# Altium schematic sheet Analogs.SchDoc
size A4
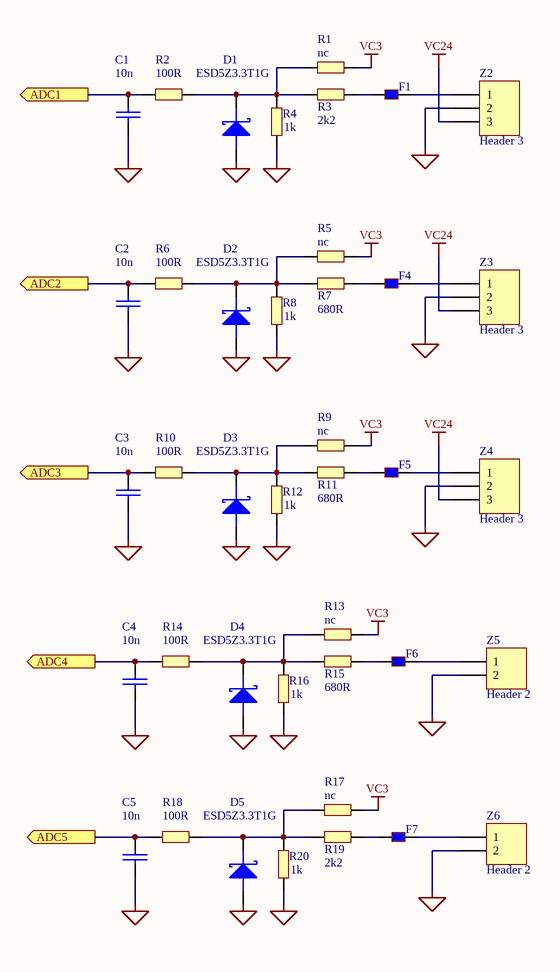
[diagram p0: Analogs.SchDoc]

## Parts
C1  10n  [0805C]
C2  10n  [0805C]
C3  10n  [0805C]
C4  10n  [0805C]
C5  10n  [0805C]
D1  ESD5Z3.3T1G  [SOD_523]
D2  ESD5Z3.3T1G  [SOD_523]
D3  ESD5Z3.3T1G  [SOD_523]
D4  ESD5Z3.3T1G  [SOD_523]
D5  ESD5Z3.3T1G  [SOD_523]
F1  BLM18BB141SN1D  [0805L]  (value not drawn)
F4  BLM18BB141SN1D  [0805L]  (value not drawn)
F5  BLM18BB141SN1D  [0805L]  (value not drawn)
F6  BLM18BB141SN1D  [0805L]  (value not drawn)
F7  BLM18BB141SN1D  [0805L]  (value not drawn)
R1  nc  [0805R]
R2  100R  [0805R]
R3  2k2  [0805R]
R4  1k  [0805R]
R5  nc  [0805R]
R6  100R  [0805R]
R7  680R  [0805R]
R8  1k  [0805R]
R9  nc  [0805R]
R10  100R  [0805R]
R11  680R  [0805R]
R12  1k  [0805R]
R13  nc  [0805R]
R14  100R  [0805R]
R15  680R  [0805R]
R16  1k  [0805R]
R17  nc  [0805R]
R18  100R  [0805R]
R19  2k2  [0805R]
R20  1k  [0805R]
Z2  Header 3  [ARC-L-3-3.5]
Z3  Header 3  [ARC-L-3-3.5]
Z4  Header 3  [ARC-L-3-3.5]
Z5  Header 2  [ARC-L-2-3.5]
Z6  Header 2  [ARC-L-2-3.5]

## Ports
ADC1 (out), ADC2 (out), ADC3 (out), ADC4 (out), ADC5 (out)

## Nets
AGND: C1.2 C2.2 C3.2 C4.2 C5.2 D1.A D2.A D3.A D4.A D5.A R4.1 R8.1 R12.1 R16.1 R20.1 Z2.2 Z3.2 Z4.2 Z5.2 Z6.2
VC3: R1.1 R5.1 R9.1 R13.1 R17.1
VC24: Z2.3 Z3.3 Z4.3
ADC1: C1.1 R2.1 ; port ADC1
ADC2: C2.1 R6.1 ; port ADC2
ADC3: C3.1 R10.1 ; port ADC3
ADC4: C4.1 R14.1 ; port ADC4
ADC5: C5.1 R18.1 ; port ADC5
NetD1_K: D1.K R1.2 R2.2 R3.2 R4.2
NetD2_K: D2.K R5.2 R6.2 R7.2 R8.2
NetD3_K: D3.K R9.2 R10.2 R11.2 R12.2
NetD4_K: D4.K R13.2 R14.2 R15.2 R16.2
NetD5_K: D5.K R17.2 R18.2 R19.2 R20.2
NetF1_1: F1.1 Z2.1
NetF1_2: F1.2 R3.1
NetF4_1: F4.1 Z3.1
NetF4_2: F4.2 R7.1
NetF5_1: F5.1 Z4.1
NetF5_2: F5.2 R11.1
NetF6_1: F6.1 Z5.1
NetF6_2: F6.2 R15.1
NetF7_1: F7.1 Z6.1
NetF7_2: F7.2 R19.1

## Library data of the parts
C1-C5 = CAP: Capacitor
D1-D5 = DIODE SCHOTTKY
F1 F4-F7 = KORALIK: Koralik ferrytowy
R1-R20 = RES3
Z2-Z4 = Header 3: Header, 3-Pin; LatestRevisionDate: 17-Jul-2002; LatestRevisionNote: Re-released for DXP Platform.; Publisher: Altium Limited
Z5 Z6 = Header 2: Header, 2-Pin; LatestRevisionDate: 17-Jul-2002; LatestRevisionNote: Re-released for DXP Platform.; Publisher: Altium Limited